# Altium schematic sheet Top_sheet.SchDoc
size A4
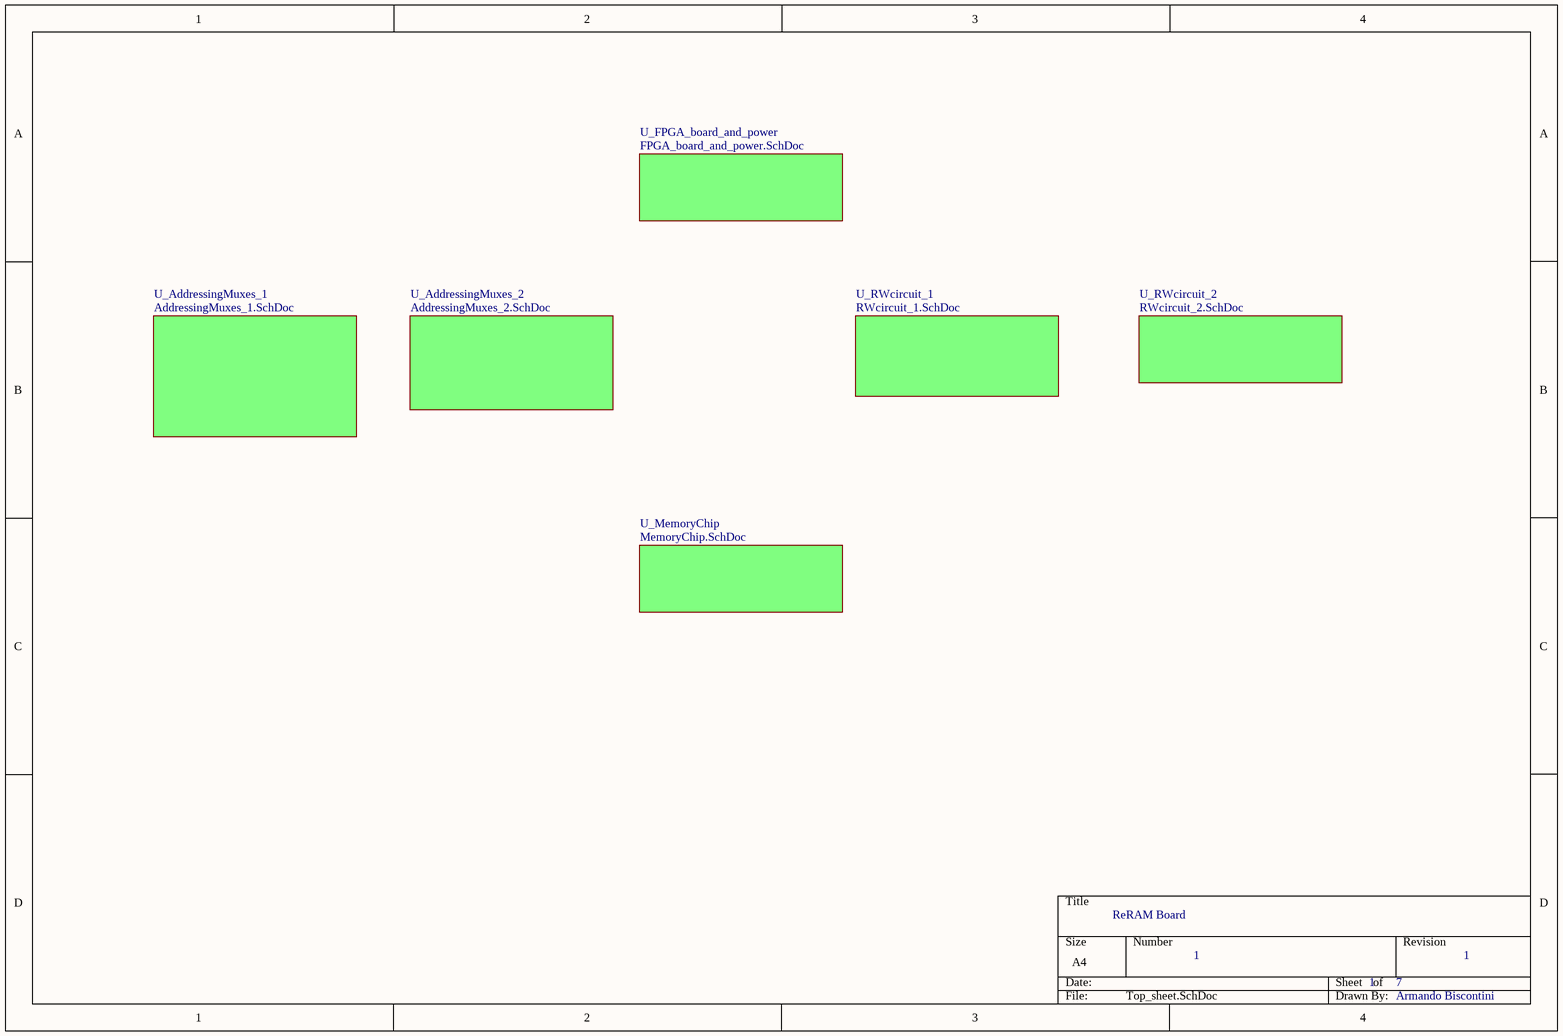
[diagram p0: Top_sheet.SchDoc]

## Sub-sheets
U_AddressingMuxes_1 = AddressingMuxes_1.SchDoc: no entries
U_AddressingMuxes_2 = AddressingMuxes_2.SchDoc: no entries
U_FPGA_board_and_power = FPGA_board_and_power.SchDoc: no entries
U_MemoryChip = MemoryChip.SchDoc: no entries
U_RWcircuit_1 = RWcircuit_1.SchDoc: no entries
U_RWcircuit_2 = RWcircuit_2.SchDoc: no entries

## Notes on the sheet
- ReRAM Board
- 1
- 7
- Armando Biscontini